# Altium project Node_TrungTam.PrjPcb
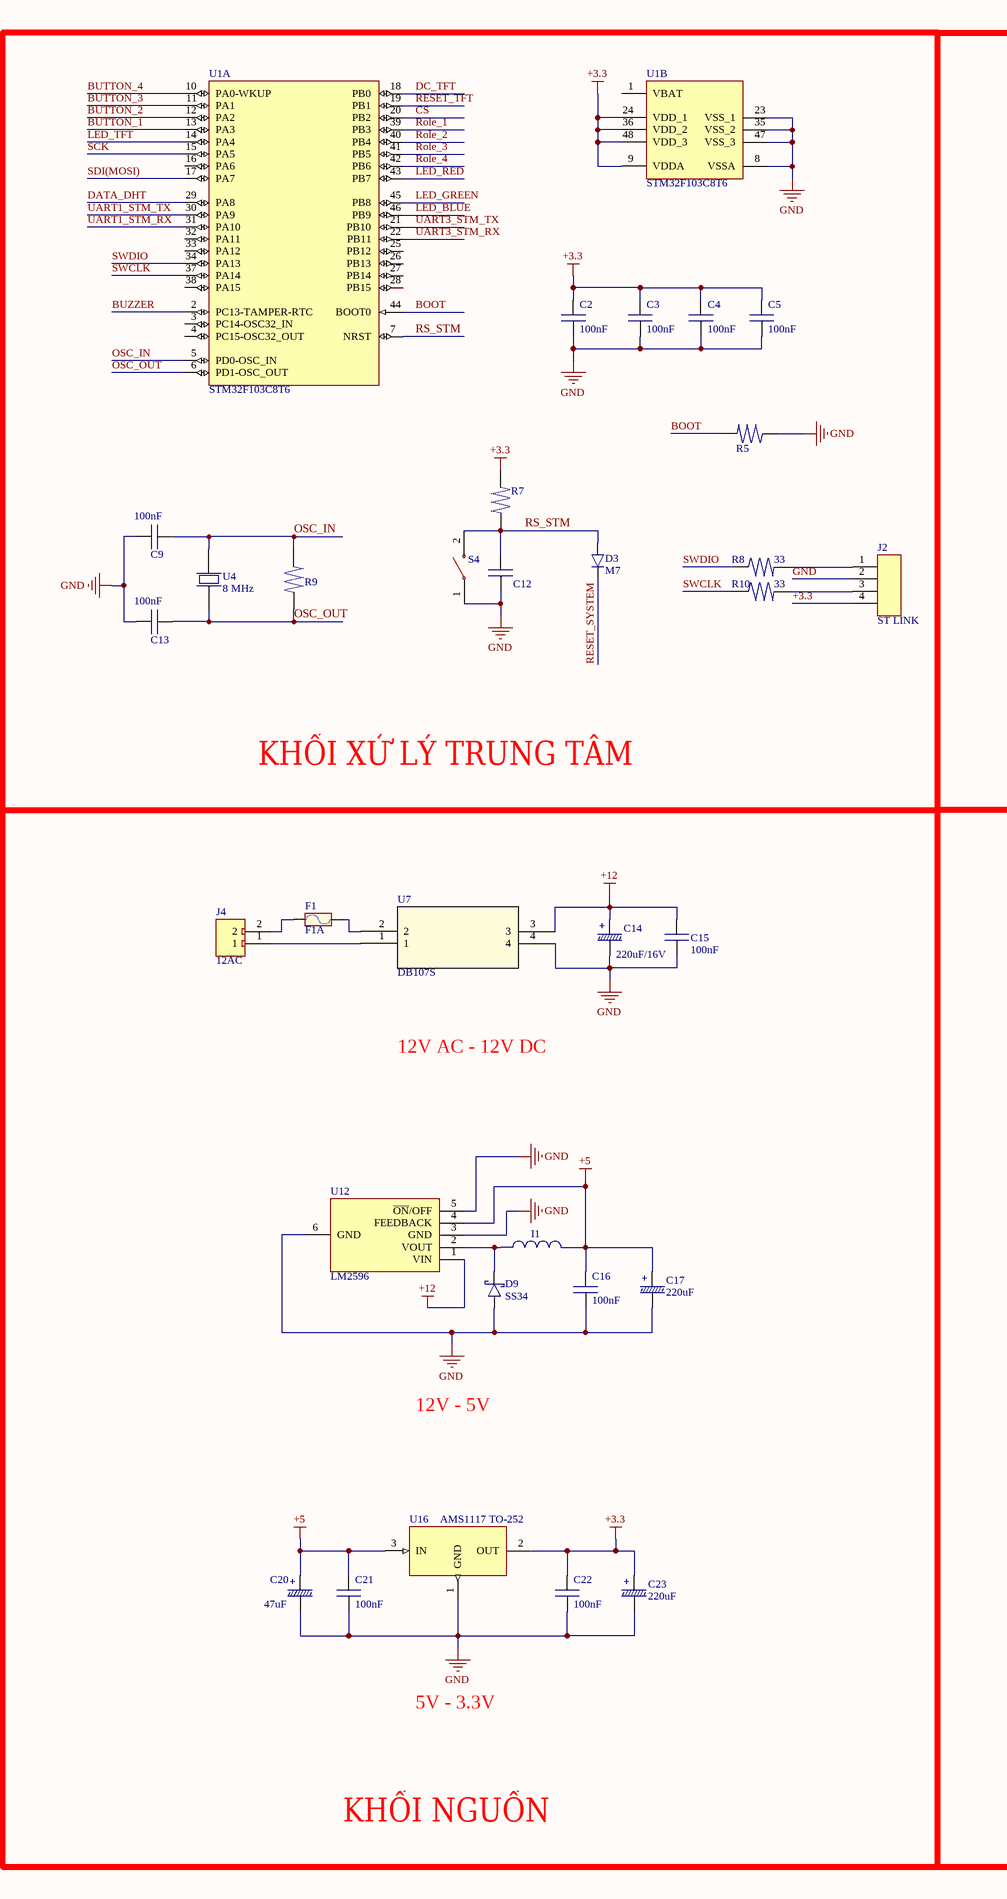
[diagram p0: Nguyen_Ly.SchDoc, left]
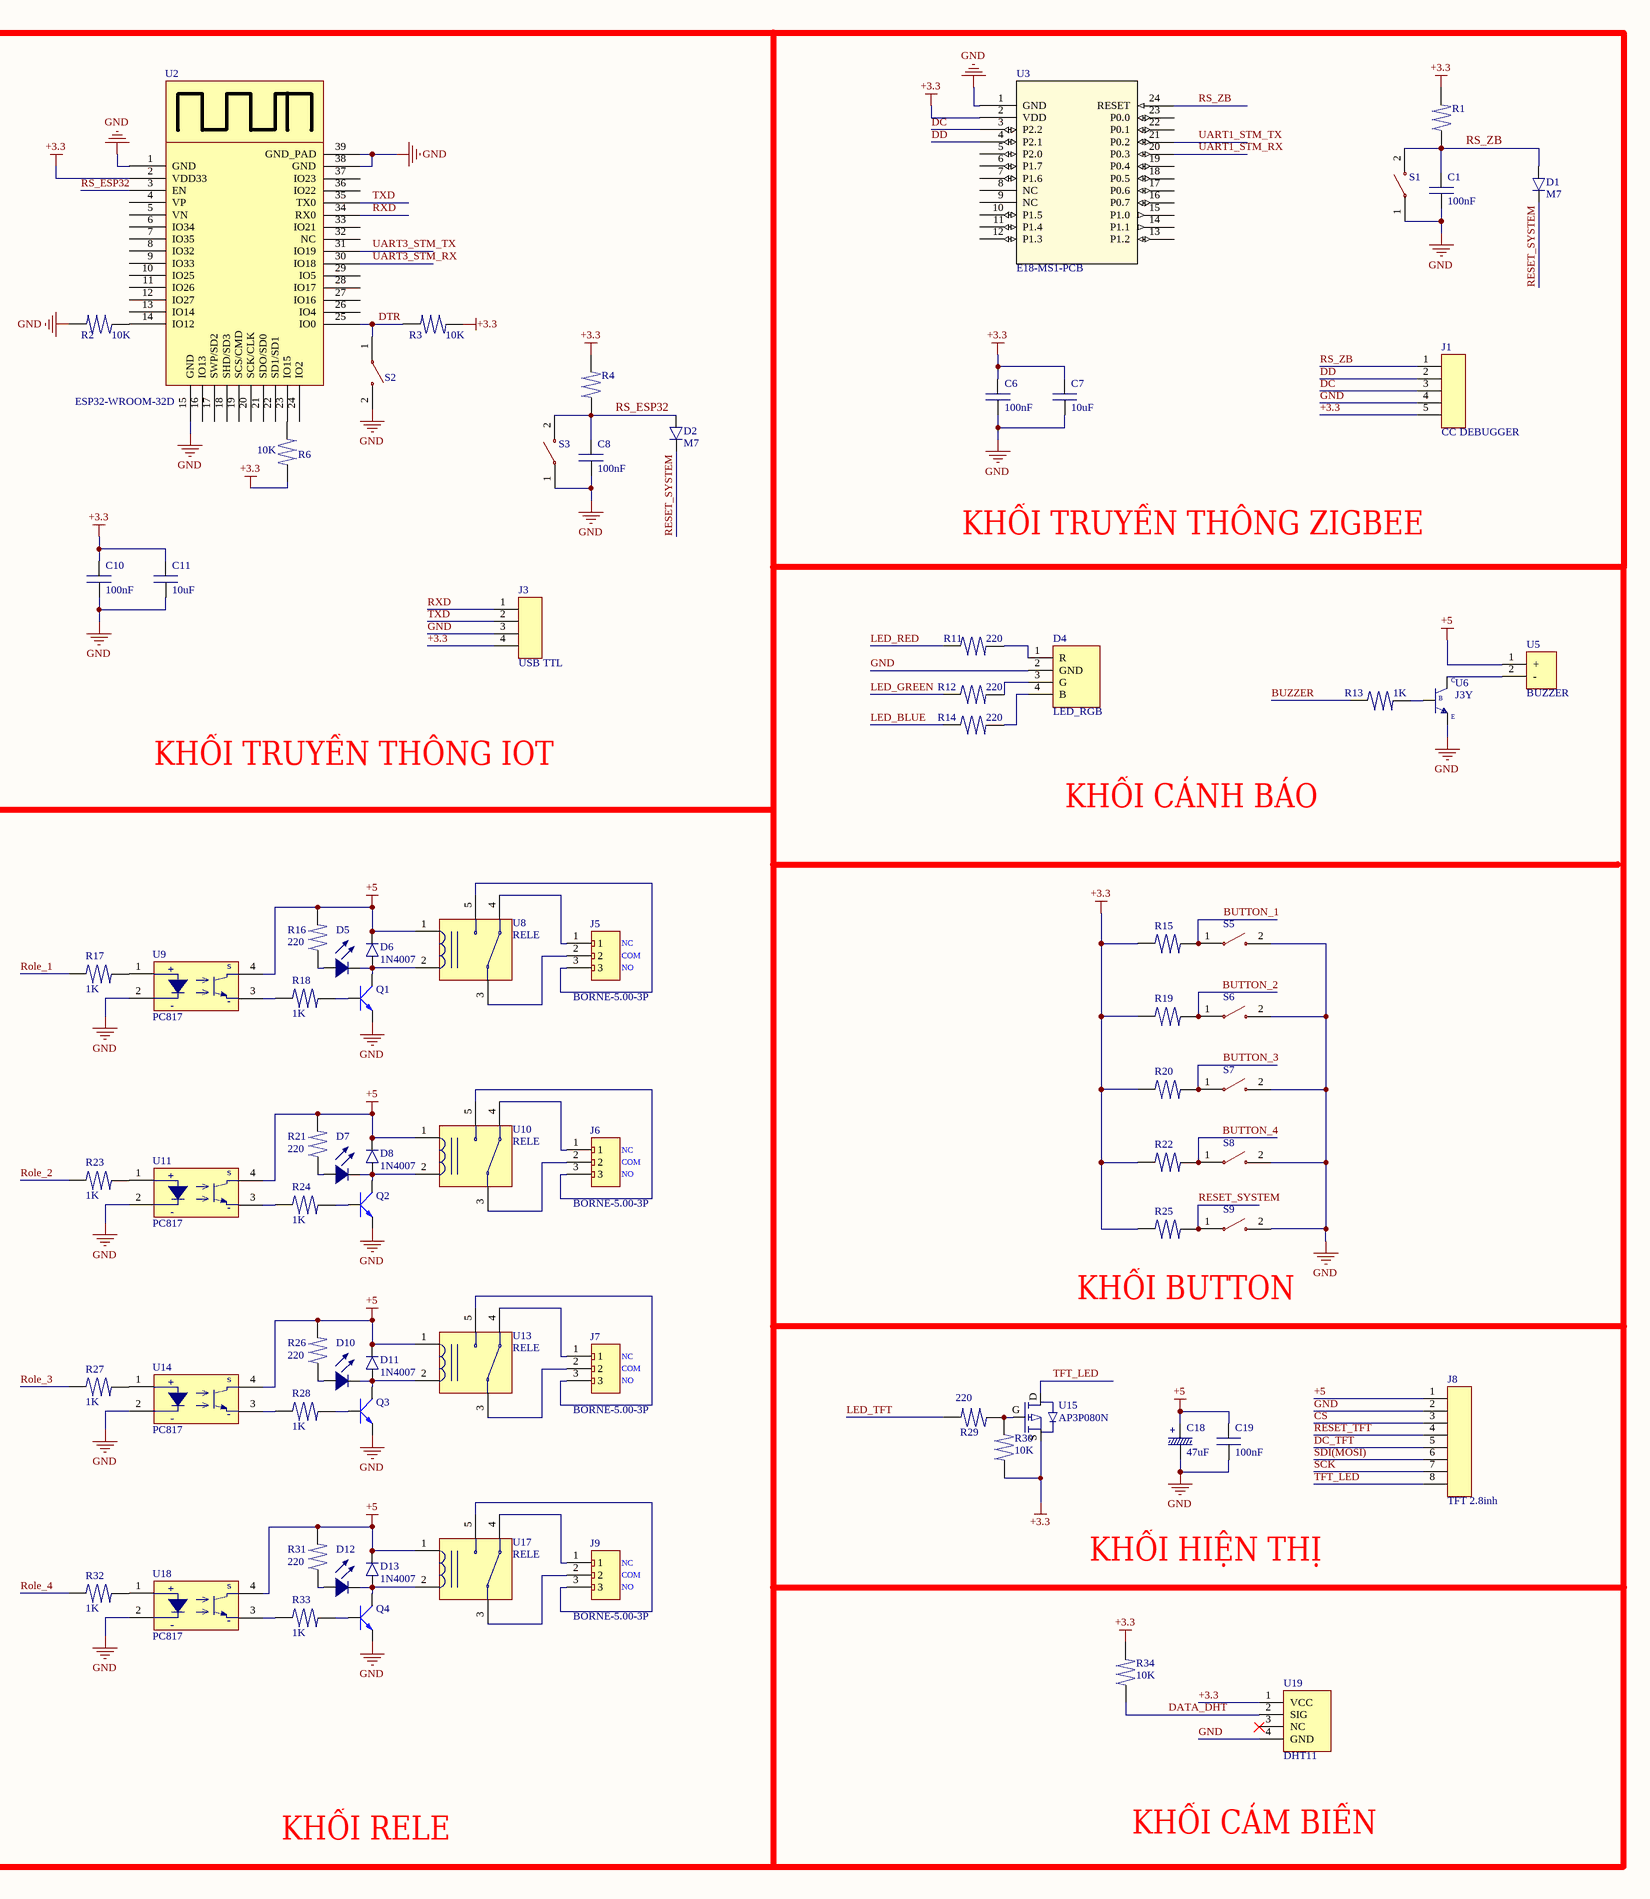
[diagram p1: Nguyen_Ly.SchDoc, right]
1 sheet, 113 parts. Net scope: global (net labels, ports and power ports of the same name join across sheets).
Board file: PCB_Final.PcbDoc

## Sheet Nguyen_Ly.SchDoc
size A2; SheetNumber: 1; SheetTotal: 1

### Parts
C1  100nF  [CAPACITOR 0805]
C2  100nF  [CAPACITOR 0805]
C3  100nF  [CAPACITOR 0805]
C4  100nF  [CAPACITOR 0805]
C5  100nF  [CAPACITOR 0805]
C6  100nF  [CAPACITOR 0805]
C7  10uF  [CAPACITOR 0805]
C8  100nF  [CAPACITOR 0805]
C9  100nF  [CAPACITOR 0805]
C10  100nF  [CAPACITOR 0805]
C11  10uF  [CAPACITOR 0805]
C12  CAPACITOR 0805  [CAPACITOR 0805]  (value not drawn)
C13  100nF  [CAPACITOR 0805]
C14  220uF/16V  [ALUMINUM_7mm]
C15  100nF  [CAPACITOR 0805]
C16  100nF  [CAPACITOR 0805]
C17  220uF  [ALUMINUM_7mm]
C18  47uF  [ALUMINUM_5mm]
C19  100nF  [CAPACITOR 0805]
C20  47uF  [ALUMINUM_5mm]
C21  100nF  [CAPACITOR 0805]
C22  100nF  [CAPACITOR 0805]
C23  220uF  [ALUMINUM_7mm]
D1  M7  [DIODE_SMA]
D2  M7  [DIODE_SMA]
D3  M7  [DIODE_SMA]
D4  LED_RGB  [LED_RGB_5mm]
D5  LED_5mm_RED  [LED_5mm_RED]  (value not drawn)
D6  1N4007  [1N4007]
D7  LED_5mm_RED  [LED_5mm_RED]  (value not drawn)
D8  1N4007  [1N4007]
D9  SS34  [DIODE_SMA]
D10  LED_5mm_RED  [LED_5mm_RED]  (value not drawn)
D11  1N4007  [1N4007]
D12  LED_5mm_RED  [LED_5mm_RED]  (value not drawn)
D13  1N4007  [1N4007]
F1  F1A  [Fuse]
I1  1260  [1260]  (value not drawn)
J1  CC DEBUGGER  [MALE-2.54-5P]
J2  ST LINK  [MALE-2.54-4P]
J3  USB TTL  [MALE-2.54-4P]
J4  12AC  [BORNE-5.00-2P]
J5  BORNE-5.00-3P  [BORNE-5.00-3P]
J6  BORNE-5.00-3P  [BORNE-5.00-3P]
J7  BORNE-5.00-3P  [BORNE-5.00-3P]
J8  TFT 2.8inh  [MALE-2.54-8P]
J9  BORNE-5.00-3P  [BORNE-5.00-3P]
Q1  C9014  [QTO-92]  (value not drawn)
Q2  C9014  [QTO-92]  (value not drawn)
Q3  C9014  [QTO-92]  (value not drawn)
Q4  C9014  [QTO-92]  (value not drawn)
R1  RESISTOR_0805  [RESISTOR_0805]  (value not drawn)
R2  10K  [RESISTOR_0805]
R3  10K  [RESISTOR_0805]
R4  RESISTOR_0805  [RESISTOR_0805]  (value not drawn)
R5  RESISTOR_0805  [RESISTOR_0805]  (value not drawn)
R6  10K  [RESISTOR_0805]
R7  RESISTOR_0805  [RESISTOR_0805]  (value not drawn)
R8  33  [RESISTOR_0805]
R9  RESISTOR_0805  [RESISTOR_0805]  (value not drawn)
R10  33  [RESISTOR_0805]
R11  220  [RESISTOR_0805]
R12  220  [RESISTOR_0805]
R13  1K  [RESISTOR_0805]
R14  220  [RESISTOR_0805]
R15  RESISTOR_0805  [RESISTOR_0805]  (value not drawn)
R16  220  [RESISTOR_PTH_9.5mm]
R17  1K  [RESISTOR_PTH_9.5mm]
R18  1K  [RESISTOR_PTH_9.5mm]
R19  RESISTOR_0805  [RESISTOR_0805]  (value not drawn)
R20  RESISTOR_0805  [RESISTOR_0805]  (value not drawn)
R21  220  [RESISTOR_PTH_9.5mm]
R22  RESISTOR_0805  [RESISTOR_0805]  (value not drawn)
R23  1K  [RESISTOR_PTH_9.5mm]
R24  1K  [RESISTOR_PTH_9.5mm]
R25  RESISTOR_0805  [RESISTOR_0805]  (value not drawn)
R26  220  [RESISTOR_PTH_9.5mm]
R27  1K  [RESISTOR_PTH_9.5mm]
R28  1K  [RESISTOR_PTH_9.5mm]
R29  220  [RESISTOR_0805]
R30  10K  [RESISTOR_0805]
R31  220  [RESISTOR_PTH_9.5mm]
R32  1K  [RESISTOR_PTH_9.5mm]
R33  1K  [RESISTOR_PTH_9.5mm]
R34  10K  [RESISTOR_0805]
S1  PUSH_BUTTON_SMD_3X4X2  [PUSH_BUTTON_SMD_3X4X2]  (value not drawn)
S2  PUSH_BUTTON_SMD_3X4X2  [PUSH_BUTTON_SMD_3X4X2]  (value not drawn)
S3  PUSH_BUTTON_SMD_3X4X2  [PUSH_BUTTON_SMD_3X4X2]  (value not drawn)
S4  PUSH_BUTTON_SMD_3X4X2  [PUSH_BUTTON_SMD_3X4X2]  (value not drawn)
S5  PUSH_BUTTON_12X12  [PUSH_BUTTON_12X12_BLUE]  (value not drawn)
S6  PUSH_BUTTON_12X12  [PUSH_BUTTON_12X12_GREEN]  (value not drawn)
S7  PUSH_BUTTON_12X12  [PUSH_BUTTON_12X12_RED]  (value not drawn)
S8  PUSH_BUTTON_12X12  [PUSH_BUTTON_12X12_YELLOW]  (value not drawn)
S9  PUSH_BUTTON_6X6  [PUSH_BUTTON_6X6]  (value not drawn)
U1  STM32F103C8T6  [STM-LQFP48_N]  (parts A,B of 2)
U2  ESP32-WROOM-32D  [ESP32-WROOM-32D]
U3  E18-MS1-PCB  [E18-MS1-PCB_BYT]
U4  8 MHz  [CRISTAL_16Mhz]
U5  BUZZER  [BUZZER_12mm]
U6  J3Y  [J3Y]
U7  DB107S  [SOIC_B107S_RTN]
U8  RELE  [RELE]
U9  PC817  [PC817_DIP]
U10  RELE  [RELE]
U11  PC817  [PC817_DIP]
U12  LM2596  [LM2596]
U13  RELE  [RELE]
U14  PC817  [PC817_DIP]
U15  AP3P080N  [SOT23-3]
U16  AMS1117 TO-252  [DPAK457P1010X238-3N]
U17  RELE  [RELE]
U18  PC817  [PC817_DIP]
U19  DHT11  [DHT11]

### Blocks framed on the sheet
KHỐI XỬ LÝ TRUNG TÂM: C2-C5 C9 C12 C13 D3 J2 R5 R7-R10 S4 U1 U4

### Nets
+3.3: C2.2 C3.2 C4.2 C5.2 C6.2 C7.2 C10.2 C11.2 C22.2 C23.1 J1.5 J2.4 J3.4 R1.2 R3.1 R4.2 R6.2 R7.2 R15.1 R19.1 R20.1 R22.1 R25.1 R30.1 R34.2 U1.9(VDDA) U1.24(VDD_1) U1.36(VDD_2) U1.48(VDD_3) U2.2(VDD33) U3.2(VDD) U15.S U16.2(OUT) U19.1(VCC)
+5: C16.2 C17.1 C18.1 C19.2 C20.1 C21.2 D6.2 D8.2 D11.2 D13.2 I1.2 J8.1 R16.2 R21.2 R26.2 R31.2 U5.1(+) U8.1 U9.4(SIGNAL) U10.1 U11.4(SIGNAL) U12.4(FEEDBACK) U13.1 U14.4(SIGNAL) U16.3(IN) U17.1 U18.4(SIGNAL)
+12: C14.1 C15.2 U7.3 U12.1(VIN)
GND: C1.1 C2.1 C3.1 C4.1 C5.1 C6.1 C7.1 C8.1 C9.2 C10.1 C11.1 C12.1 C13.2 C14.2 C15.1 C16.1 C17.2 C18.2 C19.1 C20.2 C21.1 C22.1 C23.2 D4.2(GND) D9.1 J1.4 J2.2 J3.3 J8.2 Q1.1(E) Q2.1(E) Q3.1(E) Q4.1(E) R2.2 R5.1 S1.1 S2.2 S3.1 S4.1 S5.2 S6.2 S7.2 S8.2 S9.2 U1.8(VSSA) U1.23(VSS_1) U1.35(VSS_2) U1.47(VSS_3) U2.1(GND) U2.15(GND) U2.38(GND) U2.39(GND_PAD) U3.1(GND) U6.2(E) U7.4 U9.2(GND) U11.2(GND) U12.3(GND) U12.5(~{ON}/OFF) U12.6(GND) U14.2(GND) U16.1(GND) U18.2(GND) U19.4(GND)
BOOT: R5.2 U1.44(BOOT0)
BUTTON_1: R15.2 S5.1 U1.13(PA3)
BUTTON_2: R19.2 S6.1 U1.12(PA2)
BUTTON_3: R20.2 S7.1 U1.11(PA1)
BUTTON_4: R22.2 S8.1 U1.10(PA0-WKUP)
BUZZER: R13.1 U1.2(PC13-TAMPER-RTC)
CS: J8.3 U1.20(PB2)
DATA_DHT: R34.1 U1.29(PA8) U19.2(SIG)
DC: J1.3 U3.3(P2.2)
DC_TFT: J8.5 U1.18(PB0)
DD: J1.2 U3.4(P2.1)
DTR: R3.2 S2.1 U2.25(IO0)
LED_BLUE: R14.1 U1.46(PB9)
LED_GREEN: R12.1 U1.45(PB8)
LED_RED: R11.1 U1.43(PB7)
LED_TFT: R29.2 U1.14(PA4)
OSC_IN: C9.1 R9.1 U1.5(PD0-OSC_IN) U4.2
OSC_OUT: C13.1 R9.2 U1.6(PD1-OSC_OUT) U4.1
RESET_SYSTEM: D1.2 D2.2 D3.2 R25.2 S9.1
RESET_TFT: J8.4 U1.19(PB1)
Role_1: R17.1 U1.39(PB3)
Role_2: R23.1 U1.40(PB4)
Role_3: R27.1 U1.41(PB5)
Role_4: R32.1 U1.42(PB6)
RS_ESP32: C8.2 D2.1 R4.1 S3.2 U2.3(EN)
RS_STM: C12.2 D3.1 R7.1 S4.2 U1.7(NRST)
RS_ZB: C1.2 D1.1 J1.1 R1.1 S1.2 U3.24(RESET)
RXD: J3.1 U2.34(RX0)
SCK: J8.7 U1.15(PA5)
SDI(MOSI): J8.6 U1.17(PA7)
SWCLK: R10.1 U1.37(PA14)
SWDIO: R8.1 U1.34(PA13)
TFT_LED: J8.8 U15.D
TXD: J3.2 U2.35(TX0)
UART1_STM_RX: U1.31(PA10) U3.20(P0.3)
UART1_STM_TX: U1.30(PA9) U3.21(P0.2)
UART3_STM_RX: U1.22(PB11) U2.30(IO18)
UART3_STM_TX: U1.21(PB10) U2.31(IO19)
NetD4_1: D4.1(R) R11.2
NetD4_3: D4.3(G) R12.2
NetD4_4: D4.4(B) R14.2
NetD5_1: D5.1 R16.1
NetD5_2: D5.2 D6.1 Q1.3(C) U8.2
NetD7_1: D7.1 R21.1
NetD7_2: D7.2 D8.1 Q2.3(C) U10.2
NetD9_2: D9.2 I1.1 U12.2(VOUT)
NetD10_1: D10.1 R26.1
NetD10_2: D10.2 D11.1 Q3.3(C) U13.2
NetD12_1: D12.1 R31.1
NetD12_2: D12.2 D13.1 Q4.3(C) U17.2
NetF1_1: F1.1 J4.2
NetF1_2: F1.2 U7.2
NetJ2_1: J2.1 R8.2
NetJ2_3: J2.3 R10.2
NetJ4_1: J4.1 U7.1
NetJ5_1: J5.1 U8.4
NetJ5_2: J5.2 U8.3
NetJ5_3: J5.3 U8.5
NetJ6_1: J6.1 U10.4
NetJ6_2: J6.2 U10.3
NetJ6_3: J6.3 U10.5
NetJ7_1: J7.1 U13.4
NetJ7_2: J7.2 U13.3
NetJ7_3: J7.3 U13.5
NetJ9_1: J9.1 U17.4
NetJ9_2: J9.2 U17.3
NetJ9_3: J9.3 U17.5
NetQ1_2: Q1.2(B) R18.2
NetQ2_2: Q2.2(B) R24.2
NetQ3_2: Q3.2(B) R28.2
NetQ4_2: Q4.2(B) R33.2
NetR2_1: R2.1 U2.14(IO12)
NetR6_1: R6.1 U2.23(IO15)
NetR13_2: R13.2 U6.1(B)
NetR17_2: R17.2 U9.1(VCC)
NetR18_1: R18.1 U9.3(GND)
NetR23_2: R23.2 U11.1(VCC)
NetR24_1: R24.1 U11.3(GND)
NetR27_2: R27.2 U14.1(VCC)
NetR28_1: R28.1 U14.3(GND)
NetR29_1: R29.1 R30.2 U15.G
NetR32_2: R32.2 U18.1(VCC)
NetR33_1: R33.1 U18.3(GND)
NetU5_2: U5.2(-) U6.3(C)

Not connected (* = marked no-connect by the designer): U1 1(VBAT) 3(PC14-OSC32_IN) 4(PC15-OSC32_OUT) 16(PA6) 25(PB12) 26(PB13) 27(PB14) 28(PB15) 32(PA11) 33(PA12) 38(PA15); U2 4(VP) 5(VN) 6(IO34) 7(IO35) 8(IO32) 9(IO33) 10(IO25) 11(IO26) 12(IO27) 13(IO14) 16(IO13) 17(SWP/SD2) 18(SHD/SD3) 19(SCS/CMD) 20(SCK/CLK) 21(SDO/SD0) 22(SD1/SD1) 24(IO2) 26(IO4) 27(IO16) 28(IO17) 29(IO5) 32(NC) 33(IO21) 36(IO22) 37(IO23); U3 5(P2.0) 6(P1.7) 7(P1.6) 8(NC) 9(NC) 10(P1.5) 11(P1.4) 12(P1.3) 13(P1.2) 14(P1.1) 15(P1.0) 16(P0.7) 17(P0.6) 18(P0.5) 19(P0.4) 22(P0.1) 23(P0.0); U19 3(NC)*

### Notes on the sheet
- KHỐI TRUYỀN THÔNG ZIGBEE
- KHỐI TRUYỀN THÔNG IOT
- KHỐI CẢNH BÁO
- (near J5) NC
- (near J5) COM
- (near J5) NO
- 12V AC - 12V DC
- (near J6) NC
- (near J6) COM
- (near J6) NO
- KHỐI BUTTON
- (near J7) NC
- (near J7) COM
- 12V - 5V
- (near J7) NO
- (near J9) NC
- KHỐI HIỆN THỊ
- (near J9) COM
- (near J9) NO
- 5V - 3.3V
- KHỐI NGUỒN
- KHỐI RELE
- KHỐI CẢM BIẾN
- (in symbol 47uF/16V) +
- (in symbol 220uF/16V) +
- (in symbol PC817) +; S; -

### Library data of the parts
C1-C13 C15 C16 C19 C21 C22 = CAPACITOR 0805: Generic Capacitor 0805, 2x1.25x1.4mm.
C14 C17 C23 = 220uF/16V: Aluminum Capacitor 220uF/16V 7mm
C18 C20 = 47uF/16V: Aluminum Capacitor 47uF/16V 5mm
D1-D3 = M7: Rectifiers Diode 1000V 1A SMA; ComponentLink1Description: Datasheet; Mouser PN: 637-M7; Digikey PN: 3191-M7CT-ND; JLCPCB PN: C330214
D4 = LED_RGB_5mm: LED RGB 4 Pins 5mm Common Cathode.; JLCPCB PN: C2837021
D5 D7 D10 D12 = LED_5mm_RED: LED PTH 5mm Red.
D6 D8 D11 D13 = 1N4007: Rectifier Diode 1000V 1A DO-41; Mouser PN: 637-1N4007; ComponentLink1Description: Datasheet; ComponentLink1URL: https://www.mouser.com/datasheet/2/849/1n4001-2577232.pdf; Digikey PN: 4617-1N4007TB-ND; JLCPCB PN: C3033995
D9 = SS34: Rectifier Schottky 40V 3A SMA; Mouser PN: 512-SS34; ComponentLink1Description: Datasheet; Digikey PN: SS34FSTR-ND; JLCPCB: C2909963
F1 = Fuse: Designed by: VanDungEvn; Value: Fuse
I1 = 1260: Generic Encapsulated Inductor 1260.
J1 = MALE-2.54-5P: Male Header Connector 2.54mm 5 Pins.; JLCPCB PN: C492404
J2 J3 = MALE-2.54-4P: Male Header Connector 2.54mm 4 Pins.; JLCPCB PN: C492403
J4 = BORNE-5.00-2P: Borne 2 Vias, Pitch 5mm.; JLCPCB PN: C91153
J5-J7 J9 = BORNE-5.00-3P: Borne 3 Vias, Pitch 5mm.; JLCPCB PN: C91154
J8 = MALE-2.54-8P: Male Header Connector 2.54mm 8 Pins.; JLCPCB  PN: C492407
Q1-Q4 = NPN_EBC: P 600mW, EBC; Value: C9014
R1-R15 R19 R20 R22 R25 R29 R30 R34 = RESISTOR_0805: Generic Resistor 0805.
R16-R18 R21 R23 R24 R26-R28 R31-R33 = RESISTOR_9.5mm: Generic Resistor 9.5mm.
S1-S4 = PUSH_BUTTON_SMD_3X4X2: Push Button Tactile Switch SMD 2 Pins 3x4x2mm.; JLCPCB PN: C231644
S5-S8 = PUSH_BUTTON_12X12: Push Button Tactile Switch PTH 4 Pins 12x12mm.; Mouser PN: 992-BUTT-12-5; JLCPCB PN: C84931
S9 = PUSH_BUTTON_6X6: Push Button Tactile Switch PTH 4 Pins 6x6mm.; JLCPCB PN: C255811
U1 = STM32F103C8T6: ARM Cortex-M3 32-bit MCU, 64 KB Flash, 20 KB Internal RAM, 37 I/Os, 48-pin LQFP, -40 to 85 degC, Tray; A/D Converter: 2x12-bit (10 Channel); FLASH Size (Prog) (kB): 64; I/Os (High Current): 37; Internal RAM Size (kB): 20; Operating Frequency(F) (Processor speed) (MHz): 72; Supply Voltage(Vcc) min (V): 2; DatasheetVersion: Rev. 16; PackageVersion: Rev. 6, 06/2013; PackageReference: LQFP48; PackageDescription: 48-Pin Low Profile Quad Flat Package, 7 x 7 mm Body, 0.5 mm Pitch; Supplier 1: Digi-Key; Supplier Part Number 1: 497-6063-ND; Supplier 2: Farnell; Supplier Part Number 2: 1447637; Supplier 3: Newark; Supplier Part Number 3: 59M2182; Supplier 4: Newark; Supplier Part Number 4: 57P1222; Supplier 5: Mouser; Supplier Part Number 5: 511-STM32F103C8T6; Core: ARM Cortex-M3; Packing: Tray; Mounting Technology: Surface Mount; PartNumber: STM32F103C8T6; ComponentLink1Description: Manufacturer URL; ComponentLink1URL: http://www.st.com/web/en/home.html; ComponentLink2Description: Datasheet; ComponentLink2URL: http://www.st.com/st-web-ui/static/active/en/resource/technical/document/datasheet/CD00161566.pdf; ComponentLink3Description: Package Specification; ComponentLink3URL: http://www.st.com/st-web-ui/static/active/en/resource/technical/document/datasheet/DM00058181.pdf
U2 = ESP32-WROOM-32D: Chip SMD 39 Pads Wifi 2.4GHz BLE 4.2 18x25.5mm w/ Antenna.; Mouser PN: ESP32-WROOM-32D-N4; Digikey PN: 1965-ESP32-WROOM-32D-N8CT-ND; ComponentLink1Description: Datasheet; ComponentLink1URL: https://www.mouser.com/datasheet/2/891/esp32_wroom_32d_esp32_wroom_32u_datasheet_en-1365844.pdf; JLCPCB PN: C82899
U3 = E18-MS1-PCB: No Description Available; Manufacturer_Name: Chengdu Ebyte Elec Tech; Copyright: Copyright (C) 2026 Ultra Librarian. All rights reserved.; Manufacturer_Part_Number: E18-MS1-PCB; RefDes: RefDes; Type: Type
U4 = CRISTAL_16Mhz: CRYSTAL 16MHZ, PTH and SMD; Mouser PN: 449-LFXTAL022786BULK; Digikey PN: 3155-16M20P2/49US-ND
U5 = BUZZER_12mm: BUZZER MAGNETIC 12MM; Digikey PN: 433-WT-1209T-ND; Mouser PN: 433-WT-1209T-ND; JLCPCB PN: C781866
U6 = J3Y: TRANSISTOR BIPOLAR (BJT) NPN 25V 500mA SOT-23-3; Digikey PN: 4518-S8050CT-ND; ComponentLink1Description: Datasheet; ComponentLink1URL: https://media.digikey.com/pdf/Data%20Sheets/UTD%20Semi%20PDFs/S8050.pdf; JLCPCB PN: C2828466
U7 = DB107S: Description; Manufacturer_Name: Rectron; Copyright: Copyright (C) 2025 Ultra Librarian. All rights reserved.; Manufacturer_Part_Number: DB107S; RefDes: RefDes; Type: Type
U8 U10 U13 U17 = RELE: Generic Rele PTH 5 Pins.
U9 U11 U14 U18 = PC817: Optocouplers Phototransistor 4 Pins, DIP and SMD.; ComponentLink1Description: Datasheet; ComponentLink1URL: https://www.farnell.com/datasheets/73758.pdf; JLCPCB PN SMD: C3025164; JLCPCB PN DIP: C3008368
U12 = LM2596: IC BUCK STEP DOWN 3A TO-263-6; ComponentLink1Description: Datasheet; ComponentLink1URL: https://www.ti.com/lit/ds/symlink/lm2596.pdf; Mouser PN: 863-LM2596DSADJG; Digikey PN: 4518-LM2596S-ADJCT-ND; JLCPCB PN: C2980822
U15 = AP3P080N: Mosfet PNP
U16 = AZ1117D-3.3TRE1: Linear Voltage Regulator IC Positive Fixed 1 Output 1A TO-252-3; MF: Diodes Inc.; MP: AZ1117D-3.3TRE1; Package: TO-252-2 Diodes Inc.; Availability: In Stock; Price: None; Purchase-URL: https://pricing.snapeda.com/search/part/AZ1117D-3.3TRE1/?ref=eda; Check_prices: https://www.snapeda.com/parts/AZ1117D-3.3TRE1/Diodes+Inc./view-part/?ref=eda; SnapEDA_Link: https://www.snapeda.com/parts/AZ1117D-3.3TRE1/Diodes+Inc./view-part/?ref=snap; Value: *
U19 = DHT11: SENSOR HUMIDITY/TEMPERATURE; Digikey PN: 1528-1228-ND